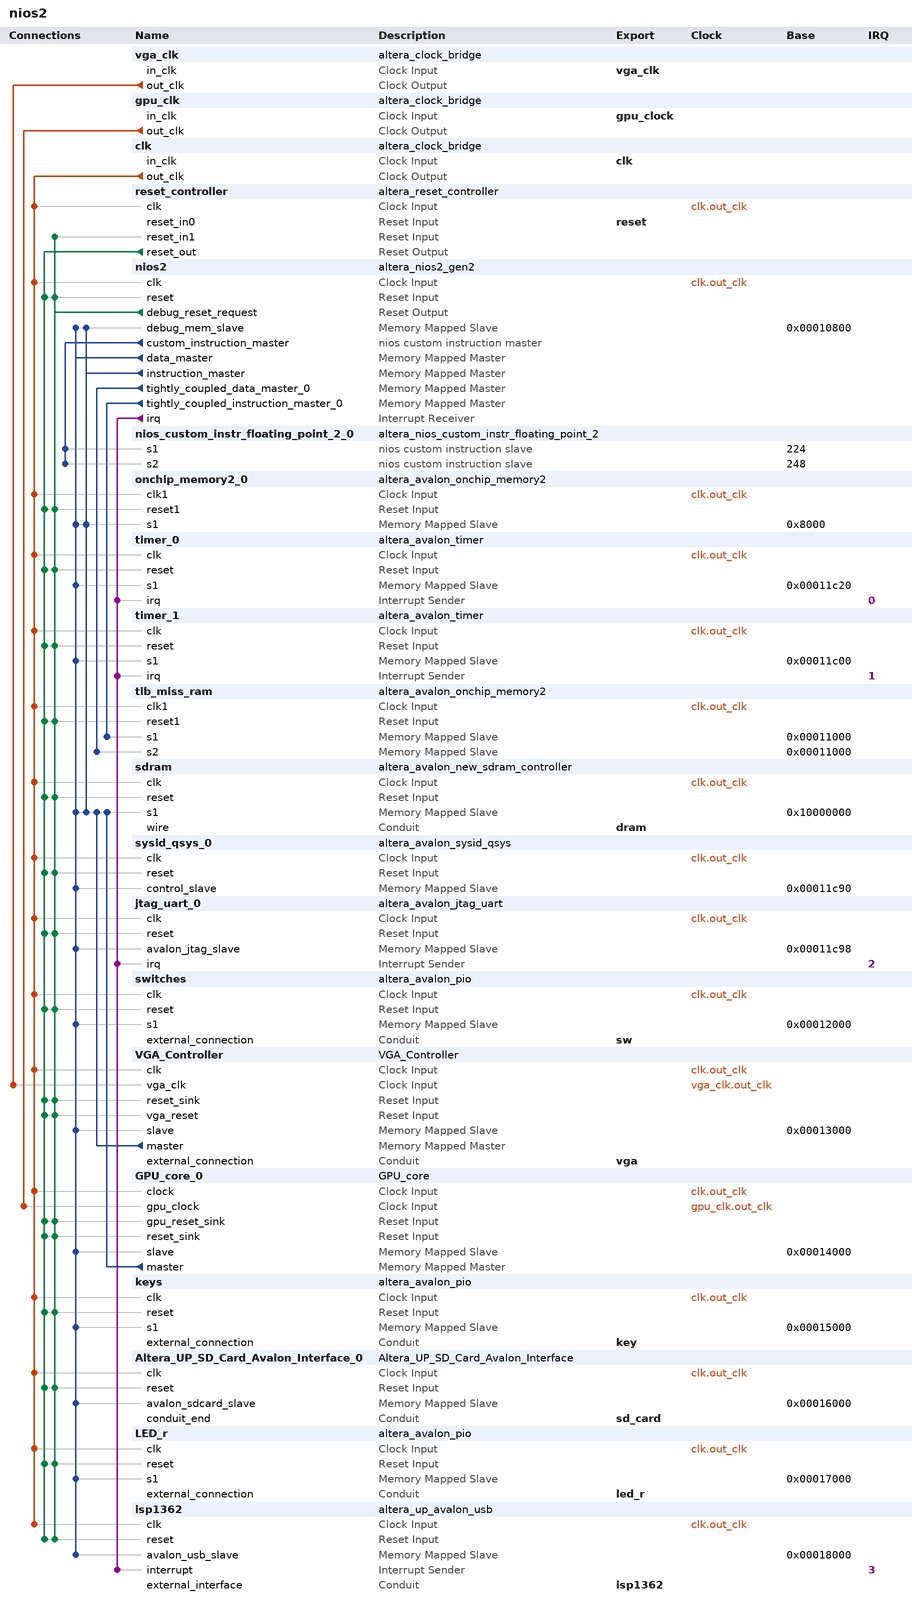
[diagram p0: system contents]
# Platform Designer (Qsys) system nios2, Cyclone IV E EP4CE115F29C7
# Parameters at their usual value, and those the tool derives, are not listed.
package require -exact qsys 18.1
create_system nios2
set_project_property DEVICE_FAMILY {Cyclone IV E}
set_project_property DEVICE EP4CE115F29C7

add_instance vga_clk altera_clock_bridge 18.1
set_instance_parameter_value vga_clk DERIVED_CLOCK_RATE 0
set_instance_parameter_value vga_clk EXPLICIT_CLOCK_RATE 40000000

add_instance gpu_clk altera_clock_bridge 18.1
set_instance_parameter_value gpu_clk DERIVED_CLOCK_RATE 0
set_instance_parameter_value gpu_clk EXPLICIT_CLOCK_RATE 100000000

add_instance clk altera_clock_bridge 18.1
set_instance_parameter_value clk DERIVED_CLOCK_RATE 0
set_instance_parameter_value clk EXPLICIT_CLOCK_RATE 90000000

add_instance reset_controller altera_reset_controller 18.1
set_instance_parameter_value reset_controller NUM_RESET_INPUTS 2
set_instance_parameter_value reset_controller SYNC_DEPTH 3

add_instance nios2 altera_nios2_gen2 18.1
set_instance_parameter_value nios2 dcache_numTCDM 1
set_instance_parameter_value nios2 dcache_size 32768
set_instance_parameter_value nios2 debug_hwbreakpoint 2
set_instance_parameter_value nios2 dividerType srt2
set_instance_parameter_value nios2 exceptionOffset 4096
set_instance_parameter_value nios2 exceptionSlave sdram.s1
set_instance_parameter_value nios2 icache_numTCIM 1
set_instance_parameter_value nios2 icache_size 16384
set_instance_parameter_value nios2 impl Fast
set_instance_parameter_value nios2 mmu_TLBMissExcSlave tlb_miss_ram.s1
set_instance_parameter_value nios2 mmu_enabled true
set_instance_parameter_value nios2 mul_64_impl 1
set_instance_parameter_value nios2 mul_shift_choice 1
set_instance_parameter_value nios2 resetSlave onchip_memory2_0.s1
set_instance_parameter_value nios2 setting_activateTrace true

add_instance nios_custom_instr_floating_point_2_0 altera_nios_custom_instr_floating_point_2 18.1
set_instance_parameter_value nios_custom_instr_floating_point_2_0 arithmetic_present true
set_instance_parameter_value nios_custom_instr_floating_point_2_0 comparison_present true
set_instance_parameter_value nios_custom_instr_floating_point_2_0 conversion_present true
set_instance_parameter_value nios_custom_instr_floating_point_2_0 root_present true

add_instance onchip_memory2_0 altera_avalon_onchip_memory2 18.1
set_instance_parameter_value onchip_memory2_0 dataWidth 32
set_instance_parameter_value onchip_memory2_0 dualPort false
set_instance_parameter_value onchip_memory2_0 initMemContent true
set_instance_parameter_value onchip_memory2_0 initializationFileName /home/evantandersen/code/fpga-gpu/software/bootloader/nios_system_bootloader.hex
set_instance_parameter_value onchip_memory2_0 memorySize 32768
set_instance_parameter_value onchip_memory2_0 useNonDefaultInitFile true

add_instance timer_0 altera_avalon_timer 18.1
set_instance_parameter_value timer_0 period 1
set_instance_parameter_value timer_0 periodUnits MSEC

add_instance timer_1 altera_avalon_timer 18.1
set_instance_parameter_value timer_1 period 1
set_instance_parameter_value timer_1 periodUnits MSEC

add_instance tlb_miss_ram altera_avalon_onchip_memory2 18.1
set_instance_parameter_value tlb_miss_ram dataWidth 32
set_instance_parameter_value tlb_miss_ram dualPort true
set_instance_parameter_value tlb_miss_ram initMemContent false
set_instance_parameter_value tlb_miss_ram initializationFileName onchip_mem.hex
set_instance_parameter_value tlb_miss_ram memorySize 1024
set_instance_parameter_value tlb_miss_ram singleClockOperation true

add_instance sdram altera_avalon_new_sdram_controller 18.1
set_instance_parameter_value sdram TAC 5.5
set_instance_parameter_value sdram TRCD 20.0
set_instance_parameter_value sdram TRP 20.0
set_instance_parameter_value sdram casLatency 3
set_instance_parameter_value sdram columnWidth 10
set_instance_parameter_value sdram dataWidth 32
set_instance_parameter_value sdram generateSimulationModel false
set_instance_parameter_value sdram model single_Micron_MT48LC4M32B2_7_chip
set_instance_parameter_value sdram numberOfBanks 4
set_instance_parameter_value sdram numberOfChipSelects 1
set_instance_parameter_value sdram powerUpDelay 200.0
set_instance_parameter_value sdram refreshPeriod 7.8125
set_instance_parameter_value sdram rowWidth 13

add_instance sysid_qsys_0 altera_avalon_sysid_qsys 18.1
set_instance_parameter_value sysid_qsys_0 id 1193099140

add_instance jtag_uart_0 altera_avalon_jtag_uart 18.1
set_instance_parameter_value jtag_uart_0 simInteractiveOptions NO_INTERACTIVE_WINDOWS

add_instance switches altera_avalon_pio 18.1
set_instance_parameter_value switches direction Input
set_instance_parameter_value switches width 18

add_instance VGA_Controller VGA_Controller 0.7.1

add_instance GPU_core_0 GPU_core 0.5.0

add_instance keys altera_avalon_pio 18.1
set_instance_parameter_value keys captureEdge true
set_instance_parameter_value keys direction Input
set_instance_parameter_value keys width 3

add_instance Altera_UP_SD_Card_Avalon_Interface_0 Altera_UP_SD_Card_Avalon_Interface 18.0

add_instance LED_r altera_avalon_pio 18.1
set_instance_parameter_value LED_r direction Output
set_instance_parameter_value LED_r width 18

add_instance isp1362 altera_up_avalon_usb 18.0

# connections
add_connection clk.out_clk Altera_UP_SD_Card_Avalon_Interface_0.clk clock
add_connection clk.out_clk GPU_core_0.clock clock
add_connection clk.out_clk isp1362.clk clock
add_connection clk.out_clk jtag_uart_0.clk clock
add_connection clk.out_clk keys.clk clock
add_connection clk.out_clk LED_r.clk clock
add_connection clk.out_clk nios2.clk clock
add_connection clk.out_clk onchip_memory2_0.clk1 clock
add_connection clk.out_clk reset_controller.clk clock
add_connection clk.out_clk sdram.clk clock
add_connection clk.out_clk switches.clk clock
add_connection clk.out_clk sysid_qsys_0.clk clock
add_connection clk.out_clk timer_0.clk clock
add_connection clk.out_clk timer_1.clk clock
add_connection clk.out_clk tlb_miss_ram.clk1 clock
add_connection clk.out_clk VGA_Controller.clk clock
add_connection gpu_clk.out_clk GPU_core_0.gpu_clock clock
add_connection vga_clk.out_clk VGA_Controller.vga_clk clock
add_connection nios2.debug_reset_request Altera_UP_SD_Card_Avalon_Interface_0.reset reset
add_connection nios2.debug_reset_request GPU_core_0.gpu_reset_sink reset
add_connection nios2.debug_reset_request GPU_core_0.reset_sink reset
add_connection nios2.debug_reset_request isp1362.reset reset
add_connection nios2.debug_reset_request jtag_uart_0.reset reset
add_connection nios2.debug_reset_request keys.reset reset
add_connection nios2.debug_reset_request LED_r.reset reset
add_connection nios2.debug_reset_request nios2.reset reset
add_connection nios2.debug_reset_request onchip_memory2_0.reset1 reset
add_connection nios2.debug_reset_request reset_controller.reset_in1 reset
add_connection nios2.debug_reset_request sdram.reset reset
add_connection nios2.debug_reset_request switches.reset reset
add_connection nios2.debug_reset_request sysid_qsys_0.reset reset
add_connection nios2.debug_reset_request timer_0.reset reset
add_connection nios2.debug_reset_request timer_1.reset reset
add_connection nios2.debug_reset_request tlb_miss_ram.reset1 reset
add_connection nios2.debug_reset_request VGA_Controller.reset_sink reset
add_connection nios2.debug_reset_request VGA_Controller.vga_reset reset
add_connection reset_controller.reset_out Altera_UP_SD_Card_Avalon_Interface_0.reset reset
add_connection reset_controller.reset_out GPU_core_0.gpu_reset_sink reset
add_connection reset_controller.reset_out GPU_core_0.reset_sink reset
add_connection reset_controller.reset_out isp1362.reset reset
add_connection reset_controller.reset_out jtag_uart_0.reset reset
add_connection reset_controller.reset_out keys.reset reset
add_connection reset_controller.reset_out LED_r.reset reset
add_connection reset_controller.reset_out nios2.reset reset
add_connection reset_controller.reset_out onchip_memory2_0.reset1 reset
add_connection reset_controller.reset_out sdram.reset reset
add_connection reset_controller.reset_out switches.reset reset
add_connection reset_controller.reset_out sysid_qsys_0.reset reset
add_connection reset_controller.reset_out timer_0.reset reset
add_connection reset_controller.reset_out timer_1.reset reset
add_connection reset_controller.reset_out tlb_miss_ram.reset1 reset
add_connection reset_controller.reset_out VGA_Controller.reset_sink reset
add_connection reset_controller.reset_out VGA_Controller.vga_reset reset
add_connection GPU_core_0.master sdram.s1 avalon
set_connection_parameter_value GPU_core_0.master/sdram.s1 arbitrationPriority 16
set_connection_parameter_value GPU_core_0.master/sdram.s1 baseAddress 0x10000000
add_connection nios2.data_master Altera_UP_SD_Card_Avalon_Interface_0.avalon_sdcard_slave avalon
set_connection_parameter_value nios2.data_master/Altera_UP_SD_Card_Avalon_Interface_0.avalon_sdcard_slave baseAddress 0x00016000
add_connection nios2.data_master GPU_core_0.slave avalon
set_connection_parameter_value nios2.data_master/GPU_core_0.slave baseAddress 0x00014000
add_connection nios2.data_master isp1362.avalon_usb_slave avalon
set_connection_parameter_value nios2.data_master/isp1362.avalon_usb_slave baseAddress 0x00018000
add_connection nios2.data_master jtag_uart_0.avalon_jtag_slave avalon
set_connection_parameter_value nios2.data_master/jtag_uart_0.avalon_jtag_slave baseAddress 0x00011c98
add_connection nios2.data_master keys.s1 avalon
set_connection_parameter_value nios2.data_master/keys.s1 baseAddress 0x00015000
add_connection nios2.data_master LED_r.s1 avalon
set_connection_parameter_value nios2.data_master/LED_r.s1 baseAddress 0x00017000
add_connection nios2.data_master nios2.debug_mem_slave avalon
set_connection_parameter_value nios2.data_master/nios2.debug_mem_slave baseAddress 0x00010800
add_connection nios2.data_master onchip_memory2_0.s1 avalon
set_connection_parameter_value nios2.data_master/onchip_memory2_0.s1 baseAddress 0x8000
add_connection nios2.data_master sdram.s1 avalon
set_connection_parameter_value nios2.data_master/sdram.s1 arbitrationPriority 8
set_connection_parameter_value nios2.data_master/sdram.s1 baseAddress 0x10000000
add_connection nios2.data_master switches.s1 avalon
set_connection_parameter_value nios2.data_master/switches.s1 baseAddress 0x00012000
add_connection nios2.data_master sysid_qsys_0.control_slave avalon
set_connection_parameter_value nios2.data_master/sysid_qsys_0.control_slave baseAddress 0x00011c90
add_connection nios2.data_master timer_0.s1 avalon
set_connection_parameter_value nios2.data_master/timer_0.s1 baseAddress 0x00011c20
add_connection nios2.data_master timer_1.s1 avalon
set_connection_parameter_value nios2.data_master/timer_1.s1 baseAddress 0x00011c00
add_connection nios2.data_master VGA_Controller.slave avalon
set_connection_parameter_value nios2.data_master/VGA_Controller.slave baseAddress 0x00013000
add_connection nios2.instruction_master nios2.debug_mem_slave avalon
set_connection_parameter_value nios2.instruction_master/nios2.debug_mem_slave baseAddress 0x00010800
add_connection nios2.instruction_master onchip_memory2_0.s1 avalon
set_connection_parameter_value nios2.instruction_master/onchip_memory2_0.s1 baseAddress 0x8000
add_connection nios2.instruction_master sdram.s1 avalon
set_connection_parameter_value nios2.instruction_master/sdram.s1 arbitrationPriority 8
set_connection_parameter_value nios2.instruction_master/sdram.s1 baseAddress 0x10000000
add_connection nios2.tightly_coupled_data_master_0 tlb_miss_ram.s2 avalon
set_connection_parameter_value nios2.tightly_coupled_data_master_0/tlb_miss_ram.s2 baseAddress 0x00011000
add_connection nios2.tightly_coupled_instruction_master_0 tlb_miss_ram.s1 avalon
set_connection_parameter_value nios2.tightly_coupled_instruction_master_0/tlb_miss_ram.s1 baseAddress 0x00011000
add_connection VGA_Controller.master sdram.s1 avalon
set_connection_parameter_value VGA_Controller.master/sdram.s1 arbitrationPriority 16
set_connection_parameter_value VGA_Controller.master/sdram.s1 baseAddress 0x10000000
add_connection nios2.irq isp1362.interrupt interrupt
set_connection_parameter_value nios2.irq/isp1362.interrupt irqNumber 3
add_connection nios2.irq jtag_uart_0.irq interrupt
set_connection_parameter_value nios2.irq/jtag_uart_0.irq irqNumber 2
add_connection nios2.irq timer_0.irq interrupt
set_connection_parameter_value nios2.irq/timer_0.irq irqNumber 0
add_connection nios2.irq timer_1.irq interrupt
set_connection_parameter_value nios2.irq/timer_1.irq irqNumber 1
add_connection nios2.custom_instruction_master nios_custom_instr_floating_point_2_0.s1 nios_custom_instruction
set_connection_parameter_value nios2.custom_instruction_master/nios_custom_instr_floating_point_2_0.s1 CIName nios_custom_instr_floating_point_2_0_1
set_connection_parameter_value nios2.custom_instruction_master/nios_custom_instr_floating_point_2_0.s1 baseAddress 224
add_connection nios2.custom_instruction_master nios_custom_instr_floating_point_2_0.s2 nios_custom_instruction
set_connection_parameter_value nios2.custom_instruction_master/nios_custom_instr_floating_point_2_0.s2 CIName nios_custom_instr_floating_point_2_0
set_connection_parameter_value nios2.custom_instruction_master/nios_custom_instr_floating_point_2_0.s2 baseAddress 248

# exported interfaces
add_interface clk clock sink
set_interface_property clk EXPORT_OF clk.in_clk
add_interface dram conduit end
set_interface_property dram EXPORT_OF sdram.wire
add_interface gpu_clock clock sink
set_interface_property gpu_clock EXPORT_OF gpu_clk.in_clk
add_interface isp1362 conduit end
set_interface_property isp1362 EXPORT_OF isp1362.external_interface
add_interface key conduit end
set_interface_property key EXPORT_OF keys.external_connection
add_interface led_r conduit end
set_interface_property led_r EXPORT_OF LED_r.external_connection
add_interface reset reset sink
set_interface_property reset EXPORT_OF reset_controller.reset_in0
add_interface sd_card conduit end
set_interface_property sd_card EXPORT_OF Altera_UP_SD_Card_Avalon_Interface_0.conduit_end
add_interface sw conduit end
set_interface_property sw EXPORT_OF switches.external_connection
add_interface vga conduit end
set_interface_property vga EXPORT_OF VGA_Controller.external_connection
add_interface vga_clk clock sink
set_interface_property vga_clk EXPORT_OF vga_clk.in_clk

set_interconnect_requirement {$system} qsys_mm.clockCrossingAdapter FIFO
set_interconnect_requirement {$system} qsys_mm.maxAdditionalLatency 1

save_system nios2.qsys
